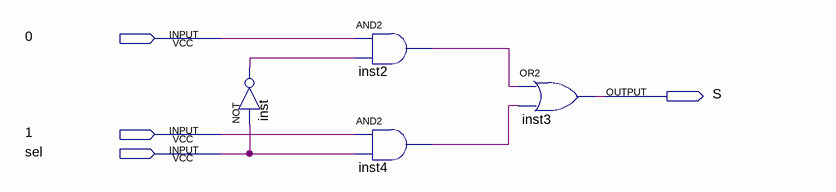
[diagram p0: schematic sheet]
// Quartus schematic mux21.bdf as structural Verilog: 4 symbols, 4 pins
module mux21 (
  input  \0 ,
  input  \1 ,
  input  sel,
  output S
);

  wire inst2_out, inst4_out, inst_out;

  not inst (inst_out, sel);
  and inst2 (inst2_out, \0 , inst_out);
  and inst4 (inst4_out, \1 , sel);
  or inst3 (S, inst2_out, inst4_out);
endmodule
